# Altium schematic sheet szervok.SchDoc
size A4
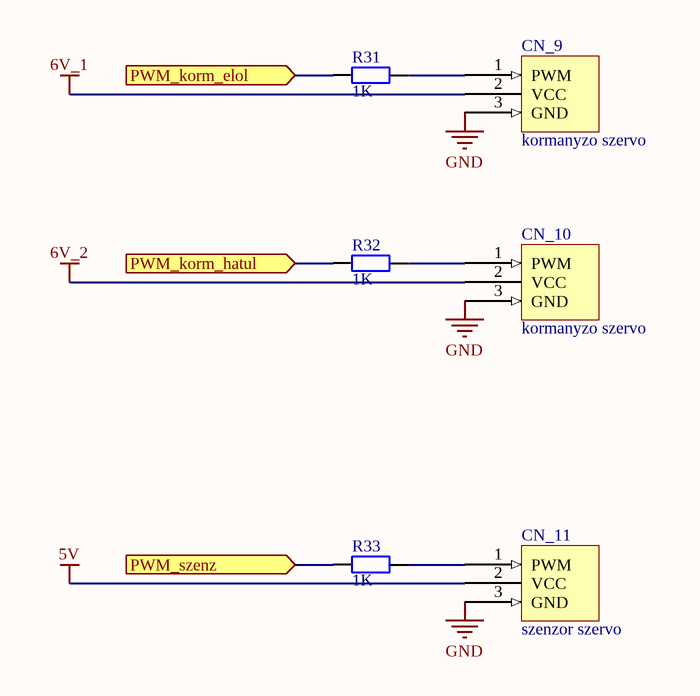
[diagram p0: szervok.SchDoc]

## Parts
CN_9  kormanyzo szervo  [FP_CONN3_TUSKE_254MM]
CN_10  kormanyzo szervo  [FP_CONN3_TUSKE_254MM]
CN_11  szenzor szervo  [FP_CONN3_TUSKE_254MM]
R31  1K  [FP_0603_RES]
R32  1K  [FP_0603_RES]
R33  1K  [FP_0603_RES]

## Ports
PWM_korm_elol (in), PWM_korm_hatul (in), PWM_szenz (in)

## Nets
5V: CN_11.2(VCC)
6V_1: CN_9.2(VCC)
6V_2: CN_10.2(VCC)
GND: CN_9.3(GND) CN_10.3(GND) CN_11.3(GND)
PWM_korm_elol: R31.1 ; port PWM_korm_elol
PWM_korm_hatul: R32.1 ; port PWM_korm_hatul
PWM_szenz: R33.1 ; port PWM_szenz
NetCN_9_1: CN_9.1(PWM) R31.2
NetCN_10_1: CN_10.1(PWM) R32.2
NetCN_11_1: CN_11.1(PWM) R33.2

## Library data of the parts
CN_9 CN_10 = MG-995 servo: reference: 100.358.11; supplier: hestore
CN_11 = HPI MS-22 servo: szenzor szervo (gyari)
R31-R33 = RES: Resistor; Value: 1K